# Altium schematic sheet BASE-B.SchDoc
size A3
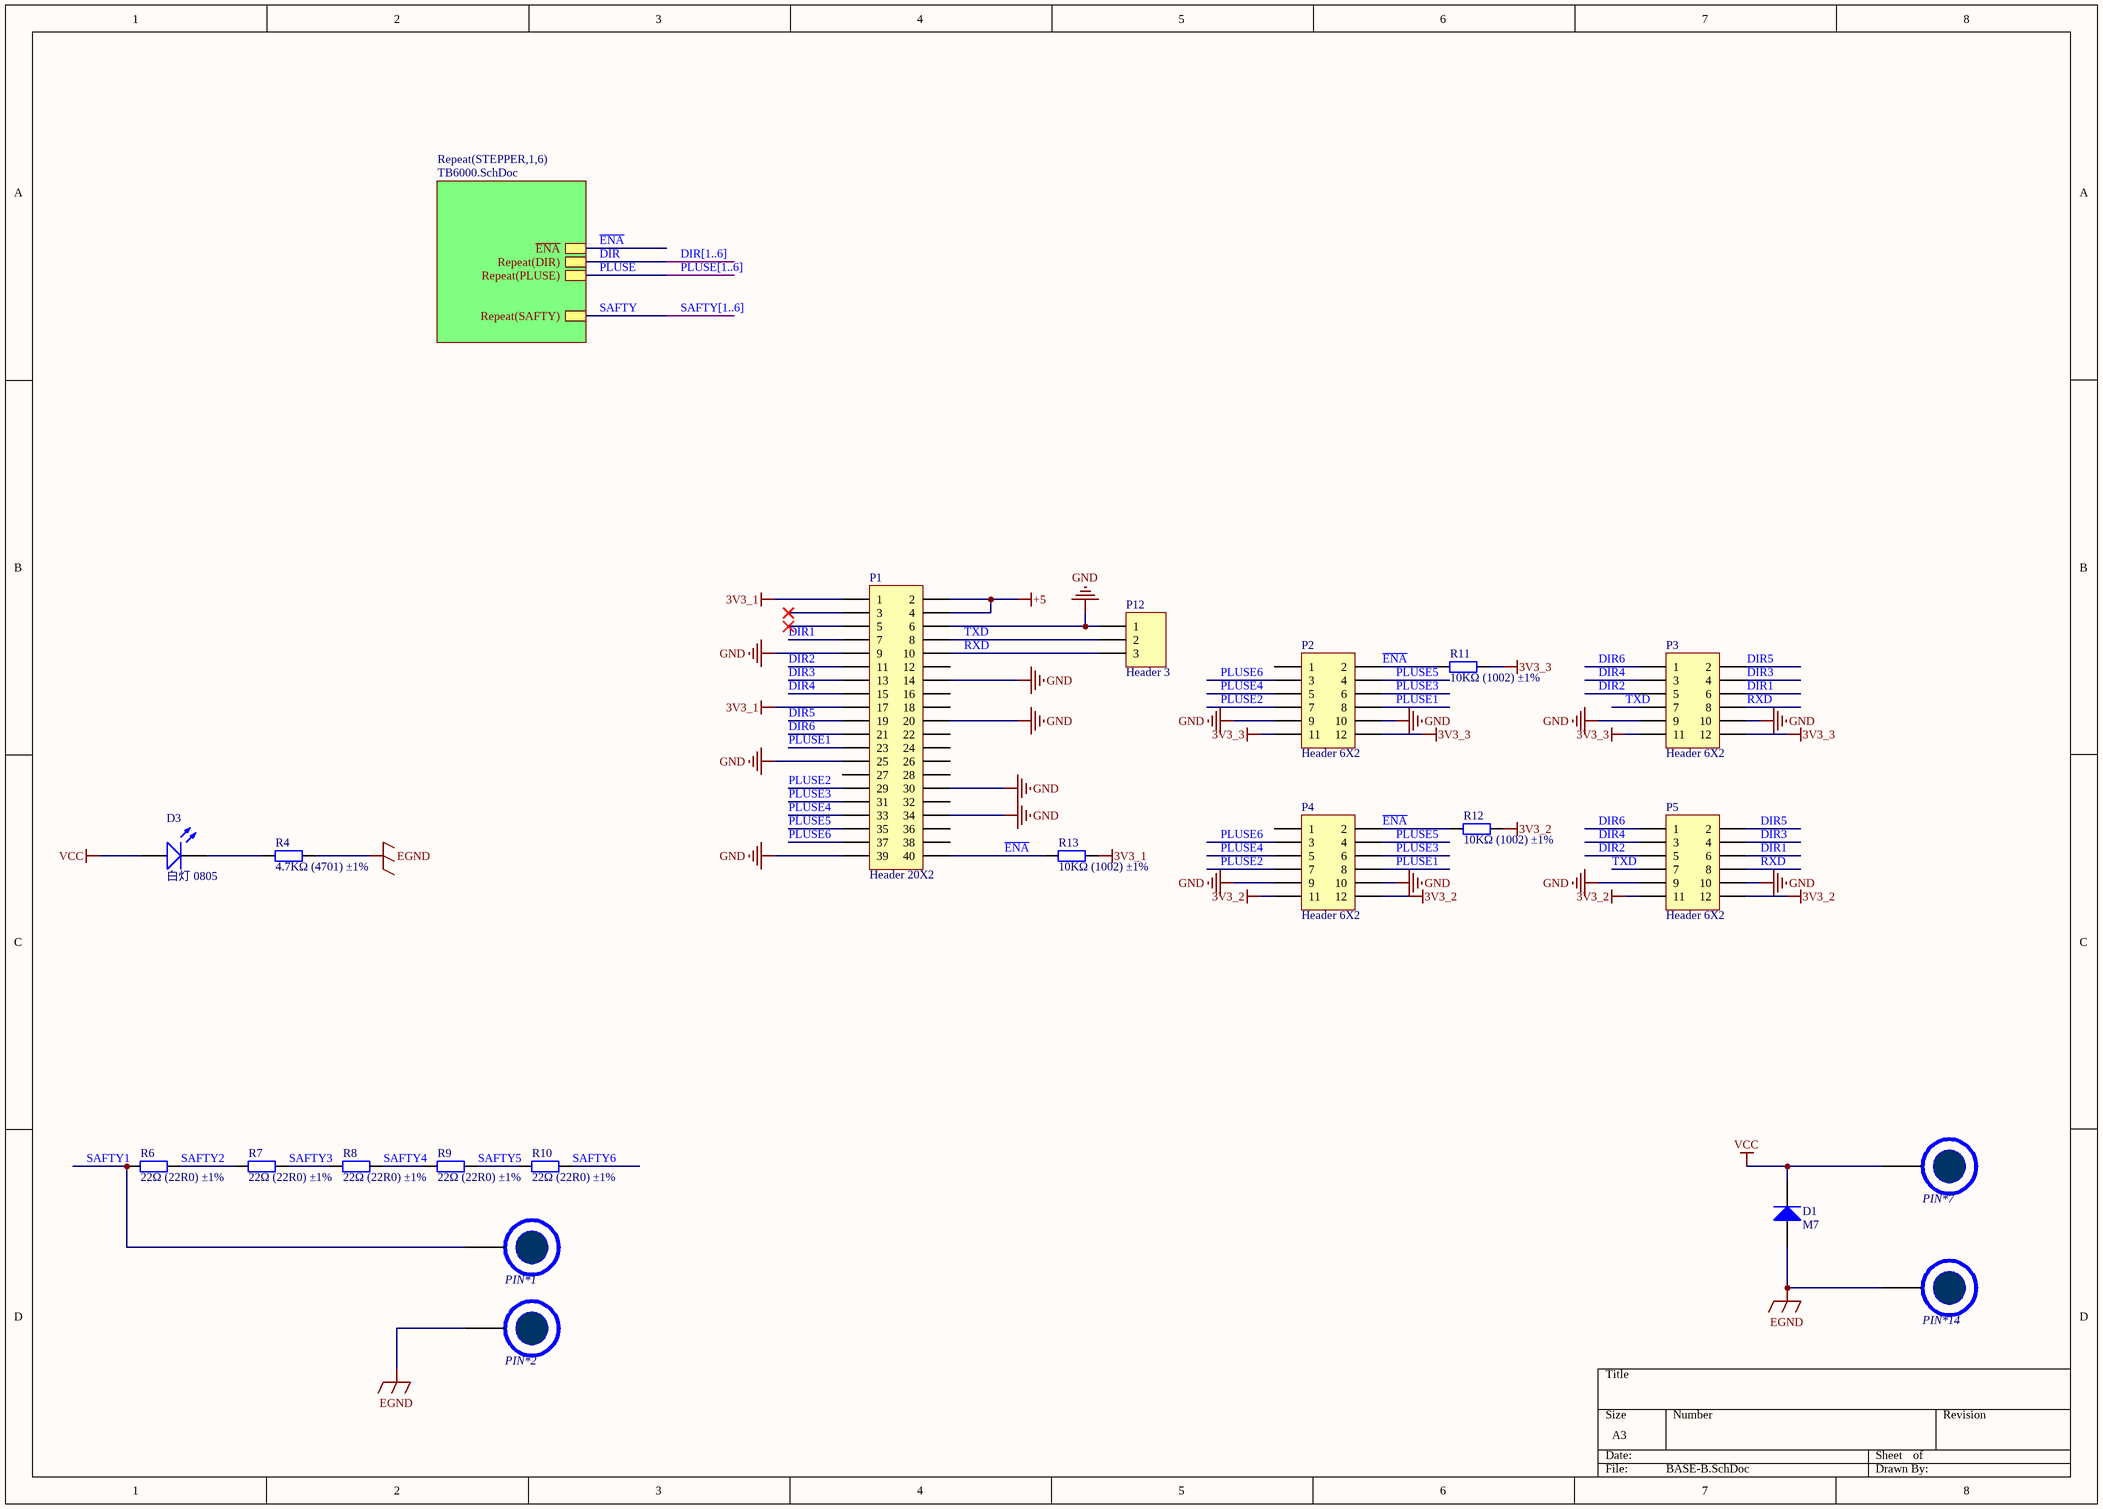
[diagram p0: BASE-B.SchDoc]

## Parts
D1  M7  [SMA(DO-214AC)_S1]
D3  白灯 0805  [0805_LED_S1]
P1  Header 20X2  [HDR2X20]
P2  Header 6X2  [HDR2X6]
P3  Header 6X2  [HDR2X6]
P4  Header 6X2  [HDR2X6]
P5  Header 6X2  [HDR2X6]
P12  Header 3  [HDR1X3]
PIN*1  PIN  [PIN]  (value not drawn)
PIN*2  PIN  [PIN]  (value not drawn)
PIN*7  PIN  [PIN]  (value not drawn)
PIN*14  PIN  [PIN]  (value not drawn)
R4  4.7KΩ (4701) ±1%  [1206_R]
R6  22Ω (22R0) ±1%  [1206_R]
R7  22Ω (22R0) ±1%  [1206_R]
R8  22Ω (22R0) ±1%  [1206_R]
R9  22Ω (22R0) ±1%  [1206_R]
R10  22Ω (22R0) ±1%  [1206_R]
R11  10KΩ (1002) ±1%  [1206_R]
R12  10KΩ (1002) ±1%  [1206_R]
R13  10KΩ (1002) ±1%  [1206_R]

## Sub-sheets
Repeat(STEPPER,1,6) = TB6000.SchDoc: ~{ENA}, Repeat(DIR), Repeat(PLUSE), Repeat(SAFTY)

## Nets
3V3_1: P1.1 P1.17 R13.2
3V3_2: P4.11 P4.12 P5.11 P5.12 R12.2
3V3_3: P2.11 P2.12 P3.11 P3.12 R11.2
+5: P1.2 P1.4
EGND: D1.1(A) PIN*2.1(PIN) PIN*14.1(PIN) R4.2
GND: P1.6 P1.9 P1.14 P1.20 P1.25 P1.30 P1.34 P1.39 P2.9 P2.10 P3.9 P3.10 P4.9 P4.10 P5.9 P5.10 P12.1
VCC: D1.2(K) D3.A PIN*7.1(PIN)
DIR: sheet Repeat(STEPPER,1,6)/Repeat(DIR)
DIR1: P1.7 P3.6 P5.6
DIR2: P1.11 P3.5 P5.5
DIR3: P1.13 P3.4 P5.4
DIR4: P1.15 P3.3 P5.3
DIR5: P1.19 P3.2 P5.2
DIR6: P1.21 P3.1 P5.1
~{ENA}: P1.40 P2.2 P4.2 R11.1 R12.1 R13.1 ; sheet Repeat(STEPPER,1,6)/~{ENA}
PLUSE: sheet Repeat(STEPPER,1,6)/Repeat(PLUSE)
PLUSE1: P1.23 P2.8 P4.8
PLUSE2: P1.29 P2.7 P4.7
PLUSE3: P1.31 P2.6 P4.6
PLUSE4: P1.33 P2.5 P4.5
PLUSE5: P1.35 P2.4 P4.4
PLUSE6: P1.37 P2.3 P4.3
RXD: P1.10 P3.8 P5.8 P12.3
SAFTY: sheet Repeat(STEPPER,1,6)/Repeat(SAFTY)
SAFTY1: PIN*1.1(PIN) R6.1
SAFTY2: R6.2 R7.1
SAFTY3: R7.2 R8.1
SAFTY4: R8.2 R9.1
SAFTY5: R9.2 R10.1
SAFTY6: R10.2
TXD: P1.8 P3.7 P5.7 P12.2
NetD3_K: D3.K R4.1

Not connected (* = marked no-connect by the designer): P1 3* 5* 12 16 18 22 24 26 27 28 32 36 38; P2 1; P4 1

## Buses and harness runs
bus DIR[1..6]
bus PLUSE[1..6]
bus SAFTY[1..6]

## Library data of the parts
D1 = SMA(DO-214AC) M7: 二极管; 备注: 1N4007 4007 编号C2464 已经停售, 使用新物料编号C95872; ComponentLink1Description: 供应商链接; ComponentLink1URL: http://www.szlcsc.com/product/details_2841.html; Package: SMA(DO-214AC); Supplier: LC; SuppliersPartNumber: C95872
D3 = 0805 白灯: 发光二极管; ComponentLink1Description: 供应商链接; ComponentLink1URL: http://www.szlcsc.com/product/details_35468.html; Package: 0805; Supplier: LC; SuppliersPartNumber: C34499
P1 = Header 20X2: Header, 20-Pin, Dual row; LatestRevisionDate: 17-Jul-2002; LatestRevisionNote: Re-released for DXP Platform.; Publisher: Altium Limited
P2-P5 = Header 6X2: Header, 6-Pin, Dual row; LatestRevisionDate: 17-Jul-2002; LatestRevisionNote: Re-released for DXP Platform.; Publisher: Altium Limited
P12 = Header 3: Header, 3-Pin; LatestRevisionDate: 17-Jul-2002; LatestRevisionNote: Re-released for DXP Platform.; Publisher: Altium Limited
R4 = 1206 4.7KΩ (4701) 1%: 贴片电阻; ComponentLink1Description: 供应商链接; ComponentLink1URL: http://www.szlcsc.com/product/details_18624.html; Package: 1206; Supplier: LC; SuppliersPartNumber: C17936
R6-R10 = 1206 22Ω (22R0) 1%: 贴片电阻; ComponentLink1Description: 供应商链接; ComponentLink1URL: http://www.szlcsc.com/product/details_18646.html; Package: 1206; Supplier: LC; SuppliersPartNumber: C17958
R11-R13 = 1206 10KΩ (1002) 1%: 贴片电阻; ComponentLink1Description: 供应商链接; ComponentLink1URL: http://www.szlcsc.com/product/details_18590.html; Package: 1206; Supplier: LC; SuppliersPartNumber: C17902